# Altium schematic sheet DiffAmp_K-10.SchDoc
size A4; SheetNumber: 1; SheetTotal: 4
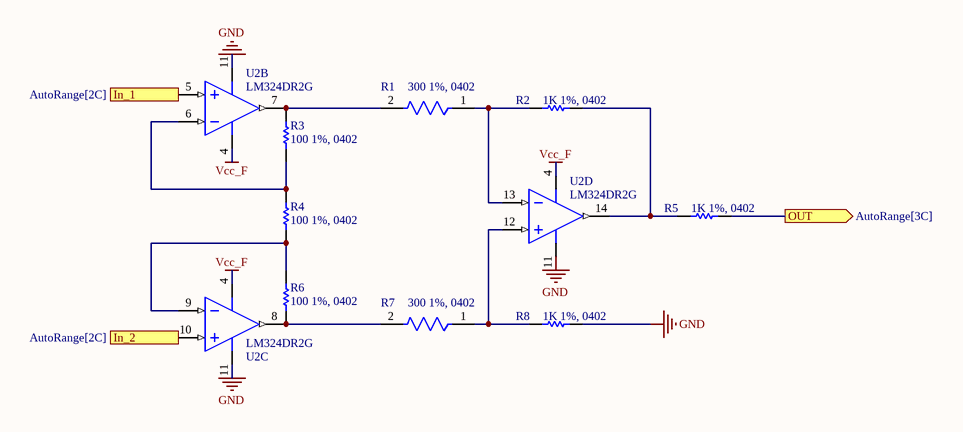
[diagram p0: DiffAmp_K-10.SchDoc]

## Parts
R1  300 1%, 0402  [FP-ERJ2RK-IPC_A]
R2  1K 1%, 0402  [RESC1005X40X25NL05T05]
R3  100 1%, 0402  [RESC1005X40X25LL05T05]
R4  100 1%, 0402  [RESC1005X40X25LL05T05]
R5  1K 1%, 0402  [RESC1005X40X25NL05T05]
R6  100 1%, 0402  [RESC1005X40X25LL05T05]
R7  300 1%, 0402  [FP-ERJ2RK-IPC_A]
R8  1K 1%, 0402  [RESC1005X40X25NL05T05]
U2  LM324DR2G  [ONSC-SOIC-14-751A-03_V]  (parts B,C,D of 4)

## Ports
In_1 (in, see AutoRange[2C]), In_2 (in, see AutoRange[2C]), OUT (out, see AutoRange[3C])

## Nets
GND: R8.2 U2.11(VEE/GND)
Vcc_F: U2.4(VCC)
In_1: U2.5(IN2+) ; port In_1
In_2: U2.10(IN3+) ; port In_2
OUT: R5.2 ; port OUT
NetR1_1: R1.1 R2.1 U2.13(IN4-)
NetR1_2: R1.2 R3.2 U2.7(OUT2)
NetR2_2: R2.2 R5.1 U2.14(OUT4)
NetR3_1: R3.1 R4.2 U2.6(IN2-)
NetR4_1: R4.1 R6.2 U2.9(IN3-)
NetR6_1: R6.1 R7.2 U2.8(OUT3)
NetR7_1: R7.1 R8.1 U2.12(IN4+)

## Notes on the sheet
- Labels drawn without touching a wire or pin: GND

## Library data of the parts
R1 R7 = CMP-1011-00449-3: RES SMD 300 OHM 1% 1/10W 0402; Power Rating: 100mW; Voltage Rating: 50V; Temperature Coefficient: 100ppm/°C; Resistance: 300R; Case Code (Imperial): 0402; Termination: SMD/SMT; REACH SVHC: No SVHC; Number of Terminations: 2; Composition: Thick Film; Case Code (Metric): 1005; Voltage Rating (DC): 50V; Packaging: Tape and Reel; Max Power Dissipation: 100mW; Tolerance: 1%; Lead Free: Lead Free; Military Standard: Not; Mount: Surface Mount; Height: 0.35mm; Package Quantity: 10000; Max Operating Temperature: 155°C; Depth: 0.5mm; Min Operating Temperature: -55°C; Length: 1mm; Contact Plating: Tin; Width: 0.02inch; Case/Package: 0402
R2 R5 R8 = CMP-1011-00510-4: Chip Resistor, 1 KOhm, +/- 1%, 100 mW, -55 to 155 degC, 0402 (1005 Metric), RoHS, Tape and Reel; PartNumber: ERJ-2RKF1001X; Manufacturer: Basic Passives; Voltage Rating: 50 V; Case\/Package: 0402; Resistance: 1 KOhm; Power Rating: 100 mW; DatasheetVersion: 04/2015; Radiation Hardening: No; Pins: 2; Height: 0.35 mm; RoHSCompliant: true; Case Code (Imperial): 0402; ComponentLink2Description: Datasheet; ComponentLink1Description: Manufacturer URL; PackageReference: 0402; Mount: Surface Mount; Package Quantity: 10000; Tolerance: 1%; ComponentLink1URL: http://www.panasonic.com/; PackageDescription: 2-Pin Surface Mount Device, Body 1 x 0.5 mm; Mounting Technology: Surface Mount; Case Code (Metric): 1005; ComponentLink2URL: http://industrial.panasonic.com/cdbs/www-data/pdf/RDA0000/AOA0000C86.pdf; REACH SVHC: Yes; Packaging: Tape and Reel; Max Operating Temperature: 155 degC; Min Operating Temperature: -55 degC; Width: 0.5 mm; Length: 1 mm
R3 R4 R6 = CMP-2002-00605-3: Chip Resistor, 100 Ohm, +/- 1%, 100 mW, -55 to 155 degC, 0402 (1005 Metric), RoHS, Tape and Reel; Manufacturer: Basic Passives; PartNumber: ERJ-2RKF1000X; Power Rating: 100 mW; Resistance: 100 Ohm; Voltage Rating: 50 V; Case\/Package: 0402; Width: 0.5 mm; Pins: 2; ComponentLink2Description: Datasheet; PackageReference: 0402; Height: 0.35 mm; Tolerance: 1%; DatasheetVersion: 04/2015; Case Code (Imperial): 0402; Min Operating Temperature: -55 degC; Radiation Hardening: No; Length: 1 mm; Package Quantity: 10000; PackageDescription: 2-Pin Surface Mount Device, Body 1 x 0.5 mm; Mounting Technology: Surface Mount; Case Code (Metric): 1005; Packaging: Tape and Reel; ComponentLink1URL: http://www.panasonic.com/; RoHSCompliant: true; Max Operating Temperature: 155 degC; REACH SVHC: Yes; ComponentLink1Description: Manufacturer URL; ComponentLink2URL: http://industrial.panasonic.com/cdbs/www-data/pdf/RDA0000/AOA0000C86.pdf; Mount: Surface Mount
U2 = CMP-1310-00171-1: Single Supply Quad Operational Amplifier, 3 to 32 V, 0 to 70 degC, 14-Pin SOIC, Pb-Free, Tape and Reel; Manufacturer: On Semiconductor; VCC Max (V): 32; VCC Min (V): 3; PackageVersion: Rev. K, 05/2011; ComponentLink3URL: http://www.onsemi.com/pub_link/Collateral/751A-03.PDF; ComponentLink3Description: Package Specification; Packing: Tape and Reel; ComponentLink2URL: http://www.onsemi.cn/pub_link/Collateral/LM324-D.PDF; PackageReference: SOIC-14-751A-03; ComponentLink1URL: http://www.onsemi.com/; PackageDescription: 14-Pin Small Outline Integrated Circuit, Body 8.65 x 3.9 mm, Pitch 1.27 mm; ComponentLink1Description: Manufacturer URL; DatasheetVersion: Rev. 25; Mounting Technology: Surface Mount; RoHS: TRUE; ComponentLink2Description: Datasheet; PartNumber: LM324DR2G